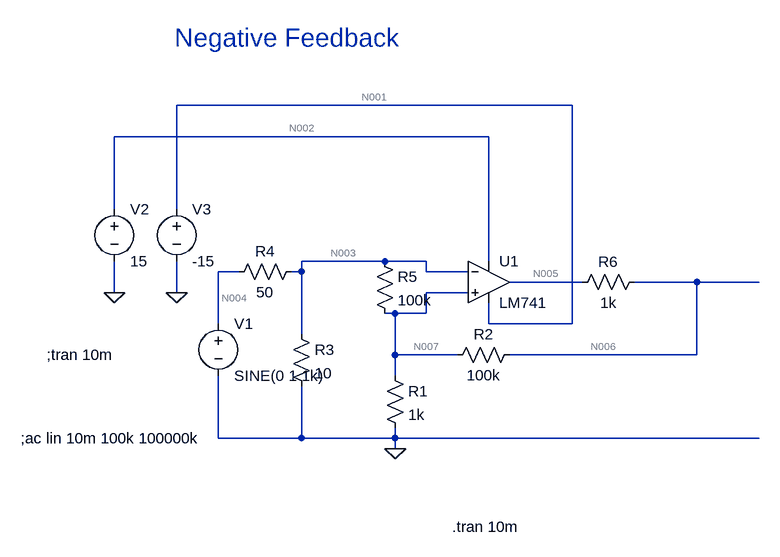
[diagram p0: schematic Draft2.asc]
Draft2.asc, the LTspice schematic file:
Version 4
SHEET 1 980 680
WIRE 496 -208 -112 -208
WIRE 368 -160 -208 -160
WIRE -208 -48 -208 -160
WIRE -112 -48 -112 -208
WIRE 208 32 80 32
WIRE 272 32 208 32
WIRE 368 32 368 -160
WIRE -16 48 -48 48
WIRE 80 48 80 32
WIRE 80 48 64 48
WIRE 272 48 272 32
WIRE 336 48 272 48
WIRE 512 64 400 64
WIRE 688 64 592 64
WIRE 784 64 688 64
WIRE -208 80 -208 32
WIRE -112 80 -112 32
WIRE 336 80 272 80
WIRE 224 112 208 112
WIRE 272 112 272 80
WIRE 272 112 224 112
WIRE -48 128 -48 48
WIRE 368 128 368 96
WIRE 496 128 496 -208
WIRE 496 128 368 128
WIRE 80 144 80 48
WIRE 224 176 224 112
WIRE 320 176 224 176
WIRE 688 176 688 64
WIRE 688 176 400 176
WIRE 224 208 224 176
WIRE -48 304 -48 208
WIRE 80 304 80 224
WIRE 80 304 -48 304
WIRE 224 304 224 288
WIRE 224 304 80 304
WIRE 784 304 224 304
WIRE 224 320 224 304
FLAG 224 320 0
FLAG -208 80 0
FLAG -112 80 0
SYMBOL voltage -48 112 R0
WINDOW 123 24 124 Left 2
WINDOW 39 0 0 Left 0
SYMATTR InstName V1
SYMATTR Value SINE(0 1 1k)
SYMBOL res 208 192 R0
SYMATTR InstName R1
SYMATTR Value 1k
SYMBOL res 416 160 R90
WINDOW 0 0 56 VBottom 2
WINDOW 3 32 56 VTop 2
SYMATTR InstName R2
SYMATTR Value 100k
SYMBOL res 64 128 R0
SYMATTR InstName R3
SYMATTR Value 10
SYMBOL res 80 32 R90
WINDOW 0 0 56 VBottom 2
WINDOW 3 32 56 VTop 2
SYMATTR InstName R4
SYMATTR Value 50
SYMBOL res 192 16 R0
SYMATTR InstName R5
SYMATTR Value 100k
SYMBOL res 608 48 R90
WINDOW 0 0 56 VBottom 2
WINDOW 3 32 56 VTop 2
SYMATTR InstName R6
SYMATTR Value 1k
SYMBOL voltage -208 -64 R0
WINDOW 123 0 0 Left 0
WINDOW 39 0 0 Left 0
SYMATTR InstName V2
SYMATTR Value 15
SYMBOL voltage -112 -64 R0
WINDOW 123 0 0 Left 0
WINDOW 39 0 0 Left 0
SYMATTR InstName V3
SYMATTR Value -15
SYMBOL OpAmps\\LM741 368 0 R0
SYMATTR InstName U1
TEXT 232 -312 Right 4 ;Negative Feedback
TEXT 312 440 Left 2 !.tran 10m
TEXT -312 176 Left 2 !;tran 10m
TEXT -352 304 Left 2 !;ac lin 10m 100k 100000k

The netlist it stands for:
* Draft2.asc
V1 N004 0 SINE(0 1 1k)
R1 N007 0 1k
R2 N006 N007 100k
R3 N003 0 10
R4 N003 N004 50
R5 N003 N007 100k
R6 N006 N005 1k
V2 N002 0 15
V3 N001 0 -15
XU1 N007 N003 N002 N001 N005 LM741  ; pins In+ In- V+ V- OUT
* Negative Feedback
.tran 10m
;tran 10m
;ac lin 10m 100k 100000k
.lib LM741.lib
.backanno
.end

* Results of the author's LTspice run, read from the files saved beside the schematic
* Operating Point, zero values left out:
*   V(n007) = -1.001 mV
*   V(n006) = -96.36 mV
*   V(n003) = -932.2 nV
*   V(n005) = -97.31 mV
*   V(n002) = 15 V
*   V(n001) = -15 V
*   I(R1) = -1.001 µA
*   I(R2) = -953.6 nA
*   I(R3) = -93.22 nA
*   I(R4) = -18.64 nA
*   I(R5) = 10 nA
*   I(R6) = 953.6 nA
*   I(V1) = -18.64 nA
*   I(V2) = -1.701 mA
*   I(V3) = 1.702 mA
*   Ix(u1:1) = 57.86 nA
*   Ix(u1:2) = 101.9 nA
*   Ix(u1:99) = 1.701 mA
*   Ix(u1:50) = -1.702 mA
*   Ix(u1:28) = 953.6 nA
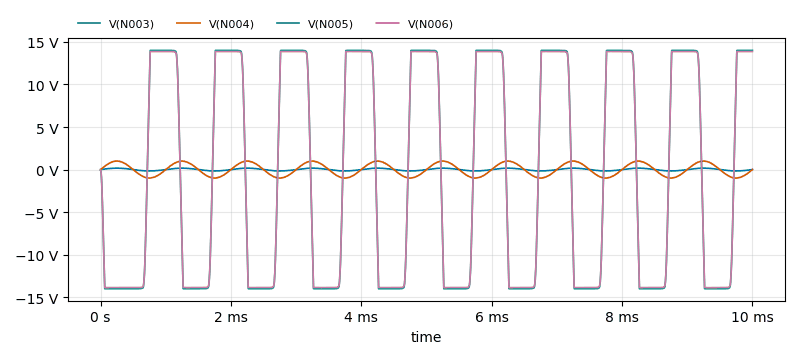
[diagram p1: Transient Analysis of Draft2.asc, plotted from the saved traces]
* Transient Analysis, 1 run:
*   V(N003): min -166.5 mV, max 166.5 mV, average 40.47 µV, rms 117.5 mV, last 13.38 µV
*   V(N004): min -1 V, max 1 V, average 254.8 µV, rms 705.6 mV, last 0 V
*   V(N005): min -14.01 V, max 14.01 V, average -461.9 mV, rms 13.13 V, last 14 V
*   V(N006): min -13.87 V, max 13.87 V, average -457.4 mV, rms 13 V, last 13.87 V